# EAGLE design uv-dosimeter-featherwing-mk-1.0 (EAGLE 7.5.0)
AUTHOR: sean@yak.net
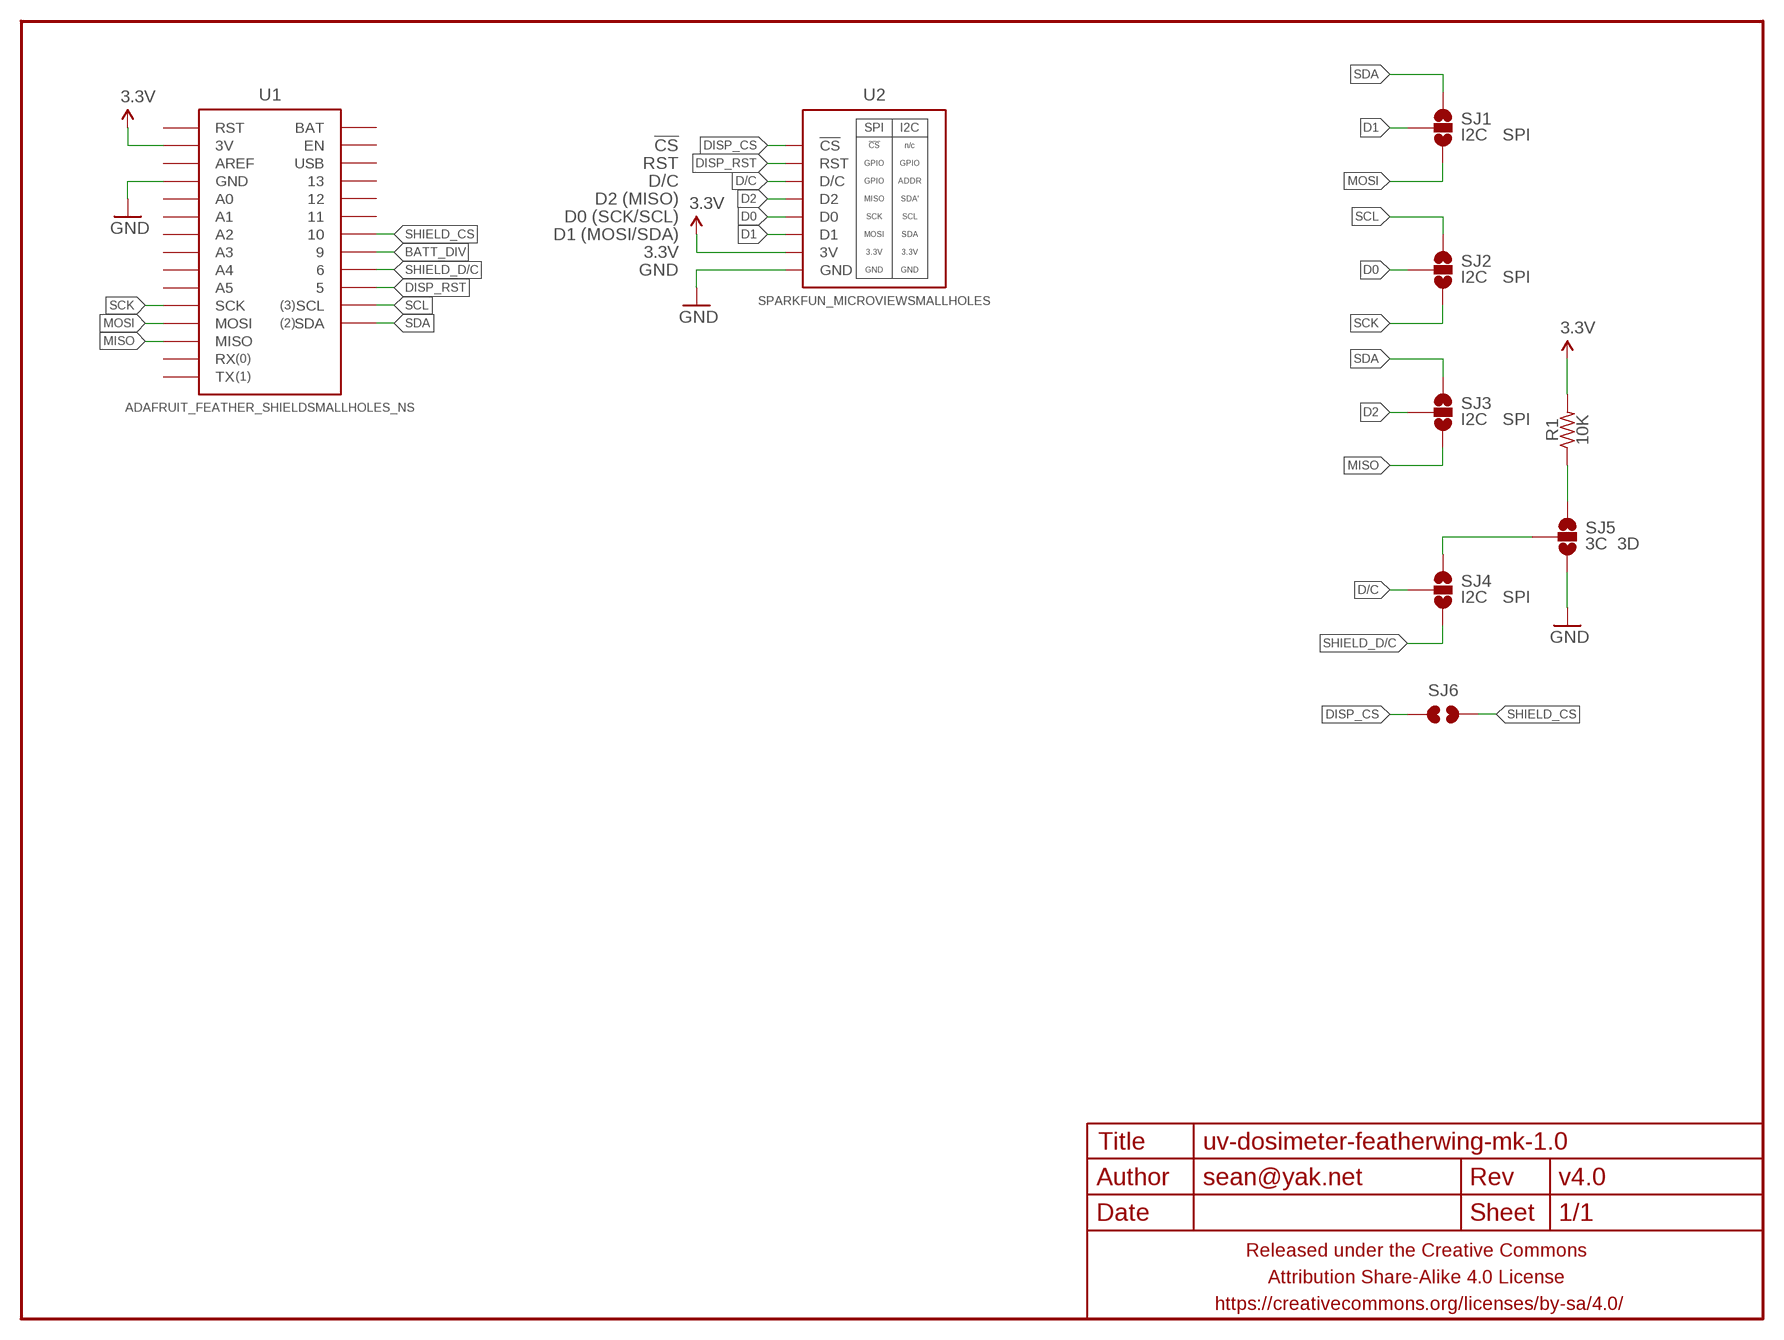
[diagram p0: schematic, sheet 1]

## Parts
FRAME1  FRAME-LETTERNO_PACKAGE  [DUMMY]
R1  10K  RESISTORR0603  [R0603]
SJ1  I2C SPI  JUMPER-PAD-3-NOFULL_BOX_SILK  [PAD-JUMPER-3-NO_YES_SILK_FULL_BOX]
SJ2  I2C SPI  JUMPER-PAD-3-NOFULL_BOX_SILK  [PAD-JUMPER-3-NO_YES_SILK_FULL_BOX]
SJ3  I2C SPI  JUMPER-PAD-3-NOFULL_BOX_SILK  [PAD-JUMPER-3-NO_YES_SILK_FULL_BOX]
SJ4  I2C SPI  JUMPER-PAD-3-NOFULL_BOX_SILK  [PAD-JUMPER-3-NO_YES_SILK_FULL_BOX]
SJ5  3C 3D  JUMPER-PAD-3-NOFULL_BOX_SILK  [PAD-JUMPER-3-NO_YES_SILK_FULL_BOX]
SJ6  JUMPER-PAD-2-NOYES_SILK  [PAD-JUMPER-2-NO_YES_SILK]
U1  ADAFRUIT_FEATHER_SHIELDSMALLHOLES_NS  [ADAFRUIT_FEATHER_SMALLHOLES_NS]
U2  SPARKFUN_MICROVIEWSMALLHOLES  [SPARKFUN-MICROVIEW-SMALLHOLES]

## Nets
3.3V: R1.2 U1.3V U2.3V
BATT_DIV: U1.9
D0: SJ2.2 U2.D0
D1: U2.D1
D2: U2.D2
D/C: U2.D/C
DISP_CS: SJ6.1 U2.CS(!CS)
DISP_RST: U1.5 U2.RST
GND: SJ5.3 U1.GND@0(GND) U1.GND@1(GND) U2.GND
MISO: SJ3.3 U1.MISO
MOSI: SJ1.3 U1.MOSI
N$1: R1.1 SJ5.1
N$2: SJ4.1 SJ5.2
SCK: SJ2.3 U1.SCK
SCL: SJ2.1 U1.SCL
SDA: SJ1.1 U1.SDA
SHIELD_CS: SJ6.2 U1.10
SHIELD_D/C: SJ4.3 U1.6
Unconnected: SJ1.2 SJ3.1 SJ3.2 SJ4.2 U1.11 U1.12 U1.13 U1.A0 U1.A1 U1.A2 U1.A3 U1.A4 U1.A5 U1.AREF U1.BAT U1.EN U1.RST U1.RX U1.TX U1.USB

## Notes on the sheet
- !CS
- RST
- D/C
- D2 (MISO)
- D0 (SCK/SCL)
- D1 (MOSI/SDA)
- 3.3V
- GND

## Library data of the parts
FRAME1 = A_butts:FRAME-LETTER: Schematic Frame Standard 8.5x11 US Letter frame; DESIGNER: sean@yak.net; VERSION: v4.0
R1 = a_parts:RESISTOR: RESISTOR, American symbol
SJ1-SJ5 = a_parts:JUMPER-PAD-3-NO
SJ6 = a_parts:JUMPER-PAD-2-NO
U1 = a_parts:ADAFRUIT_FEATHER_SHIELD
U2 = a_parts:SPARKFUN_MICROVIEW

## Board
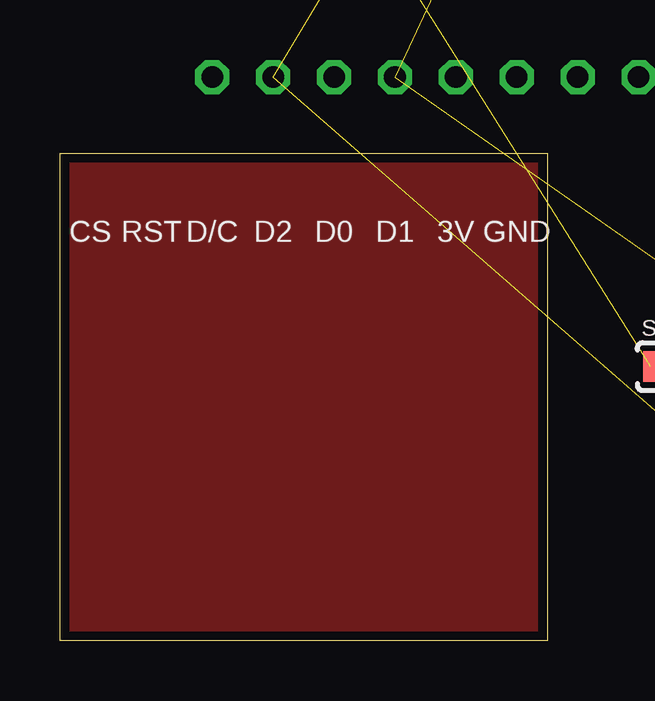
[diagram p1: board, top side]
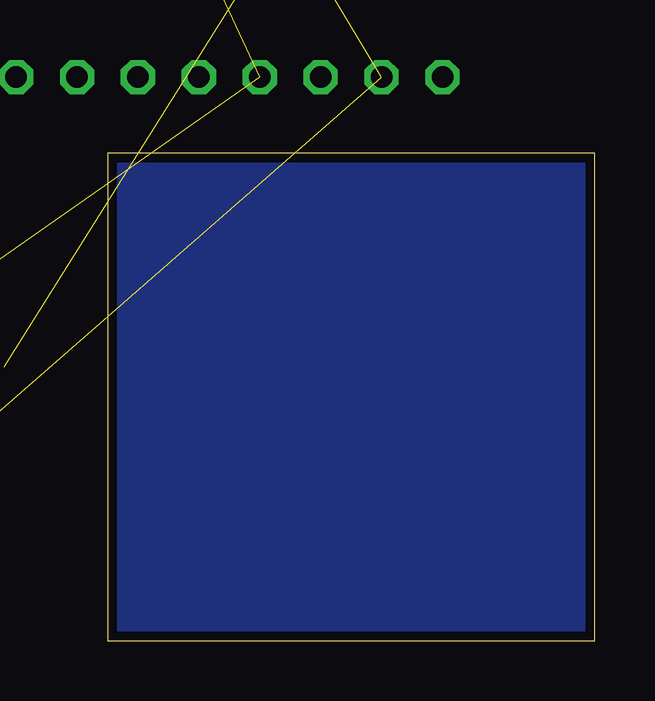
[diagram p2: board, bottom side, seen from below]

Size 20.32 x 20.32 mm. Coordinates in mm from the lower left corner, seen from the top.
Outline: 0,20.32 20.32,20.32 20.32,0 0,0 0,20.32
Copper layers (1*16): Top 0.0356mm / dielectric 1.5011mm / Bottom 0.0356mm
Design rules "LaenPCBOrder_2": minimum track width 6mil, minimum drill 13mil, track to track 6mil, track to pad 6mil, pad to pad 6mil, via to via 6mil, smd to smd 6mil, copper to edge 15mil, drill to drill 6mil, minimum pad ring 7mil, minimum via ring 7mil, stop-mask expansion 3mil, vias tented up to drill 20mil, thermal gap 10mil

### Footprints (pad centres in the part's own frame; a part is rotated, then mirrored left to right if it is on the bottom)
R0603 = smd 1 x 1.1: 1 -0.85,0; 2 0.85,0
PAD-JUMPER-3-NO_YES_SILK_FULL_BOX = smd 1.2 x 1.6: 1 -1.524,0; 2 0,0; 3 1.524,0
PAD-JUMPER-2-NO_YES_SILK = smd 0.635 x 1.27: 1 -0.45,0; 2 0.45,0
ADAFRUIT_FEATHER_SMALLHOLES_NS = drill 0.9 pad 1.422 octagon: 3V -16.51,-10.16; 5 13.97,10.16; 6 11.43,10.16; 9 8.89,10.16; 10 6.35,10.16; 11 3.81,10.16; 12 1.27,10.16; 13 -1.27,10.16; A0 -8.89,-10.16; A1 -6.35,-10.16; A2 -3.81,-10.16; A3 -1.27,-10.16; A4 1.27,-10.16; A5 3.81,-10.16; AREF -13.97,-10.16; BAT -8.89,10.16; EN -6.35,10.16; GND@0 -11.43,-10.16; GND@1 19.05,-10.16; MISO 11.43,-10.16; MOSI 8.89,-10.16; RST -19.05,-10.16; RX 13.97,-10.16; SCK 6.35,-10.16; SCL 16.51,10.16; SDA 19.05,10.16; TX 16.51,-10.16; USB -3.81,10.16
SPARKFUN-MICROVIEW-SMALLHOLES = drill 0.9 pad 1.422 octagon: 3V 6.35,8.89; CS -8.89,8.89; D0 1.27,8.89; D1 3.81,8.89; D2 -1.27,8.89; D/C -3.81,8.89; GND 8.89,8.89; RST -6.35,8.89

### Placement (x,y rotation side)
FRAME1  0,0 270 bottom
R1  27.94,7.62 180 top  (outside the outline)
SJ1  40.64,11.43 270 top  (outside the outline)
SJ2  36.83,11.75 270 top  (outside the outline)
SJ3  44.45,11.75 270 top  (outside the outline)
SJ4  32.7,11.75 90 top  (outside the outline)
SJ5  28.57,11.75 90 top  (outside the outline)
SJ6  25.08,11.43 0 top  (outside the outline)
U1  25.4,33.66 0 top  (outside the outline)
U2  13.97,33.66 0 top  (outside the outline)
U$1  [COW_SMALL]  43.18,5.71 0 bottom  (outside the outline)
U$3  [OSHWLOGO_TINY_SILKONLY]  38.1,6.35 0 bottom  (outside the outline)

### Tracks (layer width: path | path; a pad name or v marks a point on that pad's centre or on a via)
3.3V  (2 unrouted)
D0  (1 unrouted)
DISP_CS  (1 unrouted)
DISP_RST  (1 unrouted)
GND  (3 unrouted)
  pour Top (rank 6): 0,20.32 20.32,20.32 20.32,0 0,0
  pour Bottom (rank 6): 0,20.32 20.32,20.32 20.32,0 0,0
MISO  (1 unrouted)
MOSI  (1 unrouted)
N$1  (1 unrouted)
N$2  (1 unrouted)
SCK  (1 unrouted)
SCL  (1 unrouted)
SDA  (1 unrouted)
SHIELD_CS  (1 unrouted)
SHIELD_D/C  (1 unrouted)

### Text on the board
tPlace: CS | RST | D/C | D2 | D0 | D1 | 3V | GND
bPlace: by schizobovine / <sean@yak.net>